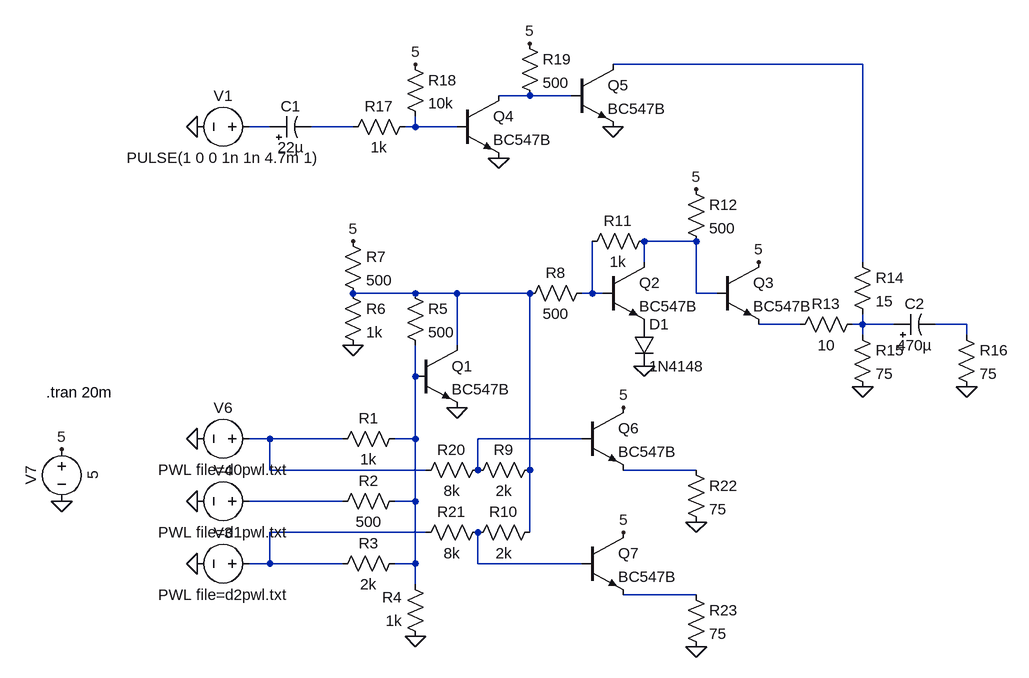
[diagram p0: schematic rgb2ypbpr.A.asc]
rgb2ypbpr.A.asc, the LTspice schematic file:
Version 4
SHEET 1 1248 680
WIRE 1040 -512 656 -512
WIRE 528 -464 480 -464
WIRE 592 -464 528 -464
WIRE 128 -416 96 -416
WIRE 256 -416 192 -416
WIRE 352 -416 352 -432
WIRE 352 -416 336 -416
WIRE 416 -416 352 -416
WIRE 784 -240 704 -240
WIRE 704 -208 704 -240
WIRE 1040 -208 1040 -512
WIRE 352 -160 256 -160
WIRE 416 -160 352 -160
WIRE 528 -160 416 -160
WIRE 624 -160 624 -240
WIRE 624 -160 608 -160
WIRE 640 -160 624 -160
WIRE 784 -160 784 -240
WIRE 816 -160 784 -160
WIRE 944 -112 880 -112
WIRE 1040 -112 1040 -128
WIRE 1040 -112 1024 -112
WIRE 1088 -112 1040 -112
WIRE 1200 -112 1152 -112
WIRE 1040 -96 1040 -112
WIRE 1200 -96 1200 -112
WIRE 416 -80 416 -160
WIRE 352 -32 352 -80
WIRE 128 64 96 64
WIRE 240 64 128 64
WIRE 352 64 352 -32
WIRE 352 64 320 64
WIRE 608 64 448 64
WIRE 128 112 128 64
WIRE 368 112 128 112
WIRE 448 112 448 64
WIRE 528 112 528 -160
WIRE 784 112 672 112
WIRE 240 160 96 160
WIRE 352 160 352 64
WIRE 352 160 320 160
WIRE 368 208 128 208
WIRE 528 208 528 112
WIRE 128 256 128 208
WIRE 128 256 96 256
WIRE 240 256 128 256
WIRE 352 256 352 160
WIRE 352 256 320 256
WIRE 448 256 448 208
WIRE 608 256 448 256
WIRE 352 288 352 256
WIRE 784 304 672 304
FLAG -192 160 0
FLAG 16 64 0
FLAG 16 160 0
FLAG 16 256 0
FLAG -192 80 5
FLAG 352 368 0
FLAG 416 16 0
FLAG 256 -240 5
FLAG 256 -80 0
FLAG 704 -48 0
FLAG 784 -320 5
FLAG 880 -208 5
FLAG 1040 -16 0
FLAG 1200 -16 0
FLAG 16 -416 0
FLAG 352 -512 5
FLAG 480 -368 0
FLAG 528 -544 5
FLAG 656 -416 0
FLAG 672 16 5
FLAG 672 208 5
FLAG 784 192 0
FLAG 784 384 0
SYMBOL voltage -192 64 R0
WINDOW 0 -32 56 VBottom 2
WINDOW 3 32 56 VTop 2
WINDOW 123 0 0 Left 0
WINDOW 39 0 0 Left 0
SYMATTR InstName V7
SYMATTR Value 5
SYMBOL voltage 112 256 R90
WINDOW 0 -32 56 VBottom 2
WINDOW 3 32 56 VTop 2
WINDOW 123 0 0 Left 0
WINDOW 39 0 0 Left 0
SYMATTR InstName V3
SYMATTR Value PWL file=d2pwl.txt
SYMBOL voltage 112 160 R90
WINDOW 0 -32 56 VBottom 2
WINDOW 3 32 56 VTop 2
WINDOW 123 0 0 Left 0
WINDOW 39 0 0 Left 0
SYMATTR InstName V4
SYMATTR Value PWL file=d1pwl.txt
SYMBOL voltage 112 64 R90
WINDOW 0 -32 56 VBottom 2
WINDOW 3 32 56 VTop 2
WINDOW 123 0 0 Left 0
WINDOW 39 0 0 Left 0
SYMATTR InstName V6
SYMATTR Value PWL file=d0pwl.txt
SYMBOL res 336 48 R90
WINDOW 0 0 56 VBottom 2
WINDOW 3 32 56 VTop 2
SYMATTR InstName R1
SYMATTR Value 1k
SYMBOL res 336 144 R90
WINDOW 0 0 56 VBottom 2
WINDOW 3 32 56 VTop 2
SYMATTR InstName R2
SYMATTR Value 500
SYMBOL res 336 240 R90
WINDOW 0 0 56 VBottom 2
WINDOW 3 32 56 VTop 2
SYMATTR InstName R3
SYMATTR Value 2k
SYMBOL res 368 384 R180
WINDOW 0 36 76 Left 2
WINDOW 3 36 40 Left 2
SYMATTR InstName R4
SYMATTR Value 1k
SYMBOL npn 352 -80 R0
SYMATTR InstName Q1
SYMATTR Value BC547B
SYMBOL res 336 -176 R0
SYMATTR InstName R5
SYMATTR Value 500
SYMBOL res 240 -176 R0
SYMATTR InstName R6
SYMATTR Value 1k
SYMBOL res 240 -256 R0
SYMATTR InstName R7
SYMATTR Value 500
SYMBOL res 624 -176 R90
WINDOW 0 0 56 VBottom 2
WINDOW 3 32 56 VTop 2
SYMATTR InstName R8
SYMATTR Value 500
SYMBOL res 544 96 R90
WINDOW 0 0 56 VBottom 2
WINDOW 3 32 56 VTop 2
SYMATTR InstName R9
SYMATTR Value 2k
SYMBOL res 544 192 R90
WINDOW 0 0 56 VBottom 2
WINDOW 3 32 56 VTop 2
SYMATTR InstName R10
SYMATTR Value 2k
SYMBOL npn 640 -208 R0
SYMATTR InstName Q2
SYMATTR Value BC547B
SYMBOL res 720 -256 R90
WINDOW 0 0 56 VBottom 2
WINDOW 3 32 56 VTop 2
SYMATTR InstName R11
SYMATTR Value 1k
SYMBOL diode 688 -112 R0
SYMATTR InstName D1
SYMATTR Value 1N4148
SYMBOL res 768 -336 R0
SYMATTR InstName R12
SYMATTR Value 500
SYMBOL npn 816 -208 R0
SYMATTR InstName Q3
SYMATTR Value BC547B
SYMBOL res 1040 -128 R90
WINDOW 0 0 56 VBottom 2
WINDOW 3 32 56 VTop 2
SYMATTR InstName R13
SYMATTR Value 10
SYMBOL res 1024 -224 R0
SYMATTR InstName R14
SYMATTR Value 15
SYMBOL res 1024 -112 R0
SYMATTR InstName R15
SYMATTR Value 75
SYMBOL res 1184 -112 R0
SYMATTR InstName R16
SYMATTR Value 75
SYMBOL voltage 112 -416 R90
WINDOW 0 -32 56 VBottom 2
WINDOW 3 32 56 VTop 2
WINDOW 123 0 0 Left 0
WINDOW 39 0 0 Left 0
SYMATTR InstName V1
SYMATTR Value PULSE(1 0 0 1n 1n 4.7m 1)
SYMBOL res 352 -432 R90
WINDOW 0 0 56 VBottom 2
WINDOW 3 32 56 VTop 2
SYMATTR InstName R17
SYMATTR Value 1k
SYMBOL res 336 -528 R0
SYMATTR InstName R18
SYMATTR Value 10k
SYMBOL npn 416 -464 R0
SYMATTR InstName Q4
SYMATTR Value BC547B
SYMBOL res 512 -560 R0
SYMATTR InstName R19
SYMATTR Value 500
SYMBOL npn 592 -512 R0
SYMATTR InstName Q5
SYMATTR Value BC547B
SYMBOL res 464 96 R90
WINDOW 0 0 56 VBottom 2
WINDOW 3 32 56 VTop 2
SYMATTR InstName R20
SYMATTR Value 8k
SYMBOL res 464 192 R90
WINDOW 0 0 56 VBottom 2
WINDOW 3 32 56 VTop 2
SYMATTR InstName R21
SYMATTR Value 8k
SYMBOL npn 608 16 R0
SYMATTR InstName Q6
SYMATTR Value BC547B
SYMBOL npn 608 208 R0
SYMATTR InstName Q7
SYMATTR Value BC547B
SYMBOL res 768 96 R0
SYMATTR InstName R22
SYMATTR Value 75
SYMBOL res 768 288 R0
SYMATTR InstName R23
SYMATTR Value 75
SYMBOL polcap 128 -400 R270
WINDOW 0 32 32 VTop 2
WINDOW 3 0 32 VBottom 2
SYMATTR InstName C1
SYMATTR Value 22µ
SYMATTR Description Capacitor
SYMATTR Type cap
SYMATTR SpiceLine V=16 Irms=0 Rser=11 Lser=0
SYMBOL polcap 1088 -96 R270
WINDOW 0 32 32 VTop 2
WINDOW 3 0 32 VBottom 2
SYMATTR InstName C2
SYMATTR Value 470µ
SYMATTR Description Capacitor
SYMATTR Type cap
SYMATTR SpiceLine V=16 Irms=395m Rser=0.2 Lser=0 mfg="Nichicon" pn="UPR1C471MPH" type="Al electrolytic"
TEXT -216 -8 Left 2 !.tran 20m

The netlist it stands for:
* rgb2ypbpr.A.asc
V7 5 0 5
V3 N017 0 PWL file=d2pwl.txt
V4 N016 0 PWL file=d1pwl.txt
V6 N013 0 PWL file=d0pwl.txt
R1 N012 N013 1k
R2 N012 N016 500
R3 N012 N017 2k
R4 0 N012 1k
Q1 N007 N012 0 0 BC547B
R5 N007 N012 500
R6 N007 0 1k
R7 5 N007 500
R8 N008 N007 500
R9 N007 N014 2k
R10 N007 N018 2k
Q2 N006 N008 P001 0 BC547B
R11 N006 N008 1k
D1 P001 0 1N4148
R12 5 N006 500
Q3 5 N006 N009 0 BC547B
R13 N010 N009 10
R14 N001 N010 15
R15 N010 0 75
R16 N011 0 75
V1 N003 0 PULSE(1 0 0 1n 1n 4.7m 1)
R17 N005 N004 1k
R18 5 N005 10k
Q4 N002 N005 0 0 BC547B
R19 5 N002 500
Q5 N001 N002 0 0 BC547B
R20 N014 N013 8k
R21 N018 N017 8k
Q6 5 N014 N015 0 BC547B
Q7 5 N018 N019 0 BC547B
R22 N015 0 75
R23 N019 0 75
C1 N003 N004 22µ V=16 Irms=0 Rser=11 Lser=0
C2 N010 N011 470µ V=16 Irms=395m Rser=0.2 Lser=0 mfg="Nichicon" pn="UPR1C471MPH" type="Al electrolytic"
.model D D
.lib standard.dio
.model NPN NPN
.model PNP PNP
.lib standard.bjt
.tran 20m
.backanno
.end